# Altium project ESC.PrjPcb
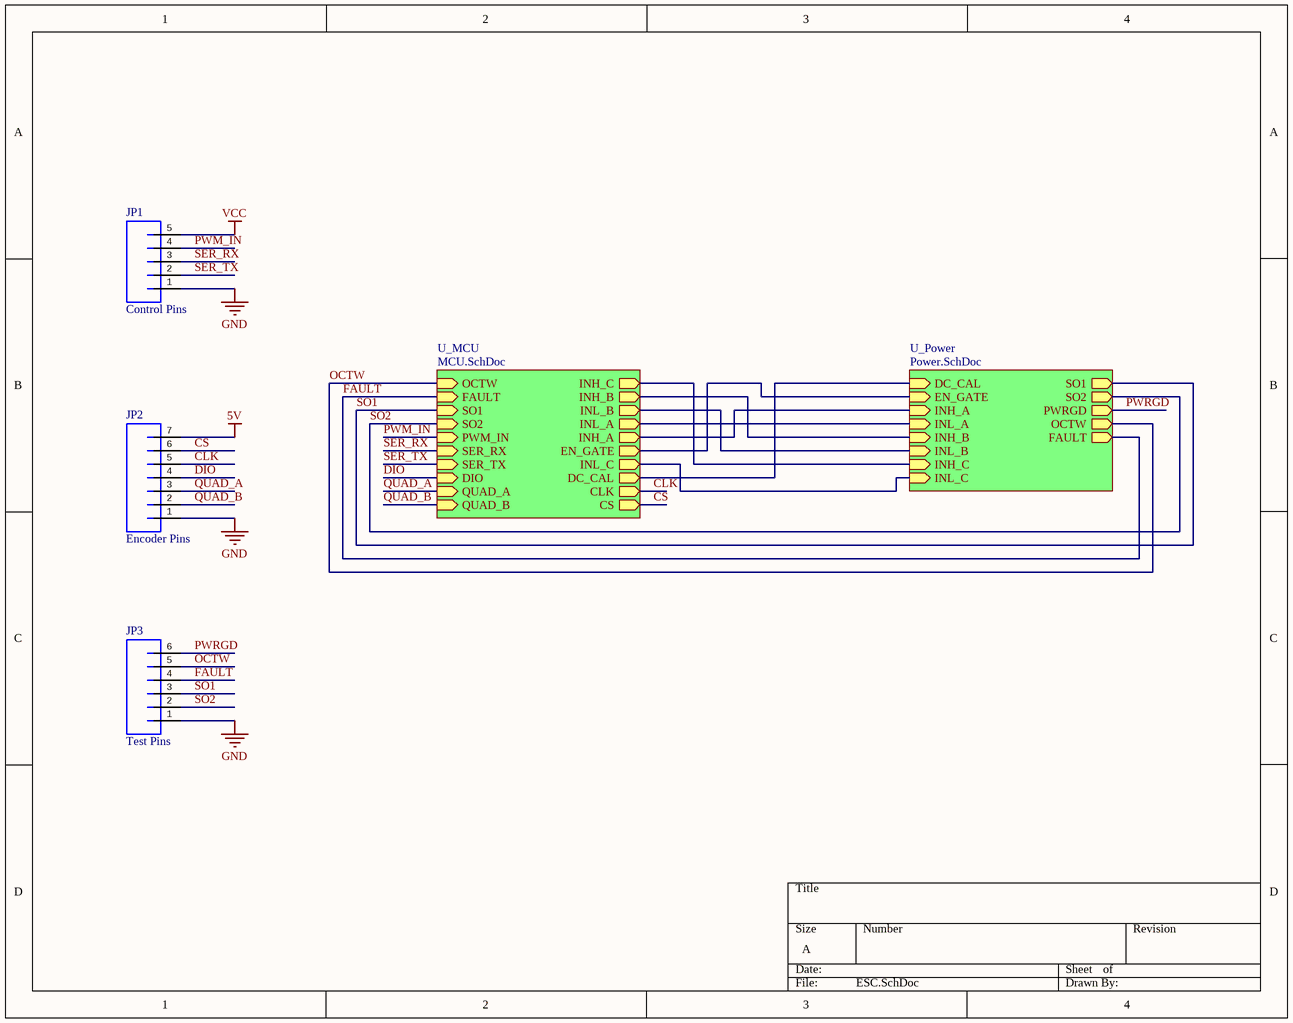
[diagram p0: ESC.SchDoc]
3 sheets, 78 parts. Net scope: hierarchical (ports join the sheet entries above them; power ports are global).
Board file: ESC.PcbDoc
Sheets:
  ESC.SchDoc
    U_Power = Power.SchDoc
    U_MCU = MCU.SchDoc

## Sheet ESC.SchDoc
size A

### Parts
JP1  Control Pins  [JST-5-PTH-VERT]
JP2  Encoder Pins  [JST-7-PTH-VERT]
JP3  Test Pins  [JST-6-PTH-VERT]

### Sub-sheets
U_MCU = MCU.SchDoc: INH_C (out), INH_B (out), INL_B (out), OCTW (in), FAULT (in), INL_A (out), INH_A (out), EN_GATE (out), INL_C (out), DC_CAL (out), SO1 (in), SO2 (in), PWM_IN (in), SER_RX (in), SER_TX (in), DIO (in), CLK (out), CS (out), QUAD_A (in), QUAD_B (in)
U_Power = Power.SchDoc: DC_CAL (in), EN_GATE (in), INH_A (in), INL_A (in), INH_B (in), INL_B (in), INH_C (in), INL_C (in), SO1 (out), SO2 (out), PWRGD (out), OCTW (out), FAULT (out)

### Nets
5V: JP2.7
GND: JP1.1 JP2.1 JP3.1
VCC: JP1.5
CLK: JP2.5 ; sheet U_MCU/CLK
CS: JP2.6 ; sheet U_MCU/CS
DIO: JP2.4 ; sheet U_MCU/DIO
FAULT: JP3.4 ; sheet U_Power/FAULT, sheet U_MCU/FAULT
OCTW: JP3.5 ; sheet U_Power/OCTW, sheet U_MCU/OCTW
PWM_IN: JP1.4 ; sheet U_MCU/PWM_IN
PWRGD: JP3.6 ; sheet U_Power/PWRGD
QUAD_A: JP2.3 ; sheet U_MCU/QUAD_A
QUAD_B: JP2.2 ; sheet U_MCU/QUAD_B
SER_RX: JP1.3 ; sheet U_MCU/SER_RX
SER_TX: JP1.2 ; sheet U_MCU/SER_TX
SO1: JP3.3 ; sheet U_Power/SO1, sheet U_MCU/SO1
SO2: JP3.2 ; sheet U_Power/SO2, sheet U_MCU/SO2
NetU1_5: sheet U_Power/INH_C, sheet U_MCU/INH_C
NetU1_9: sheet U_Power/INH_B, sheet U_MCU/INH_B
NetU1_10: sheet U_Power/INL_B, sheet U_MCU/INL_B
NetU1_19/A5: sheet U_Power/DC_CAL, sheet U_MCU/DC_CAL
NetU1_20/A6: sheet U_Power/INL_C, sheet U_MCU/INL_C
NetU1_21/A7: sheet U_Power/EN_GATE, sheet U_MCU/EN_GATE
NetU1_22/A8: sheet U_Power/INH_A, sheet U_MCU/INH_A
NetU1_23/A9: sheet U_Power/INL_A, sheet U_MCU/INL_A

### Library data of the parts
JP1 = JST_5_VERT
JP2 = JST_7_VERT
JP3 = JST_6_VERT

## Sheet Power.SchDoc
size A4
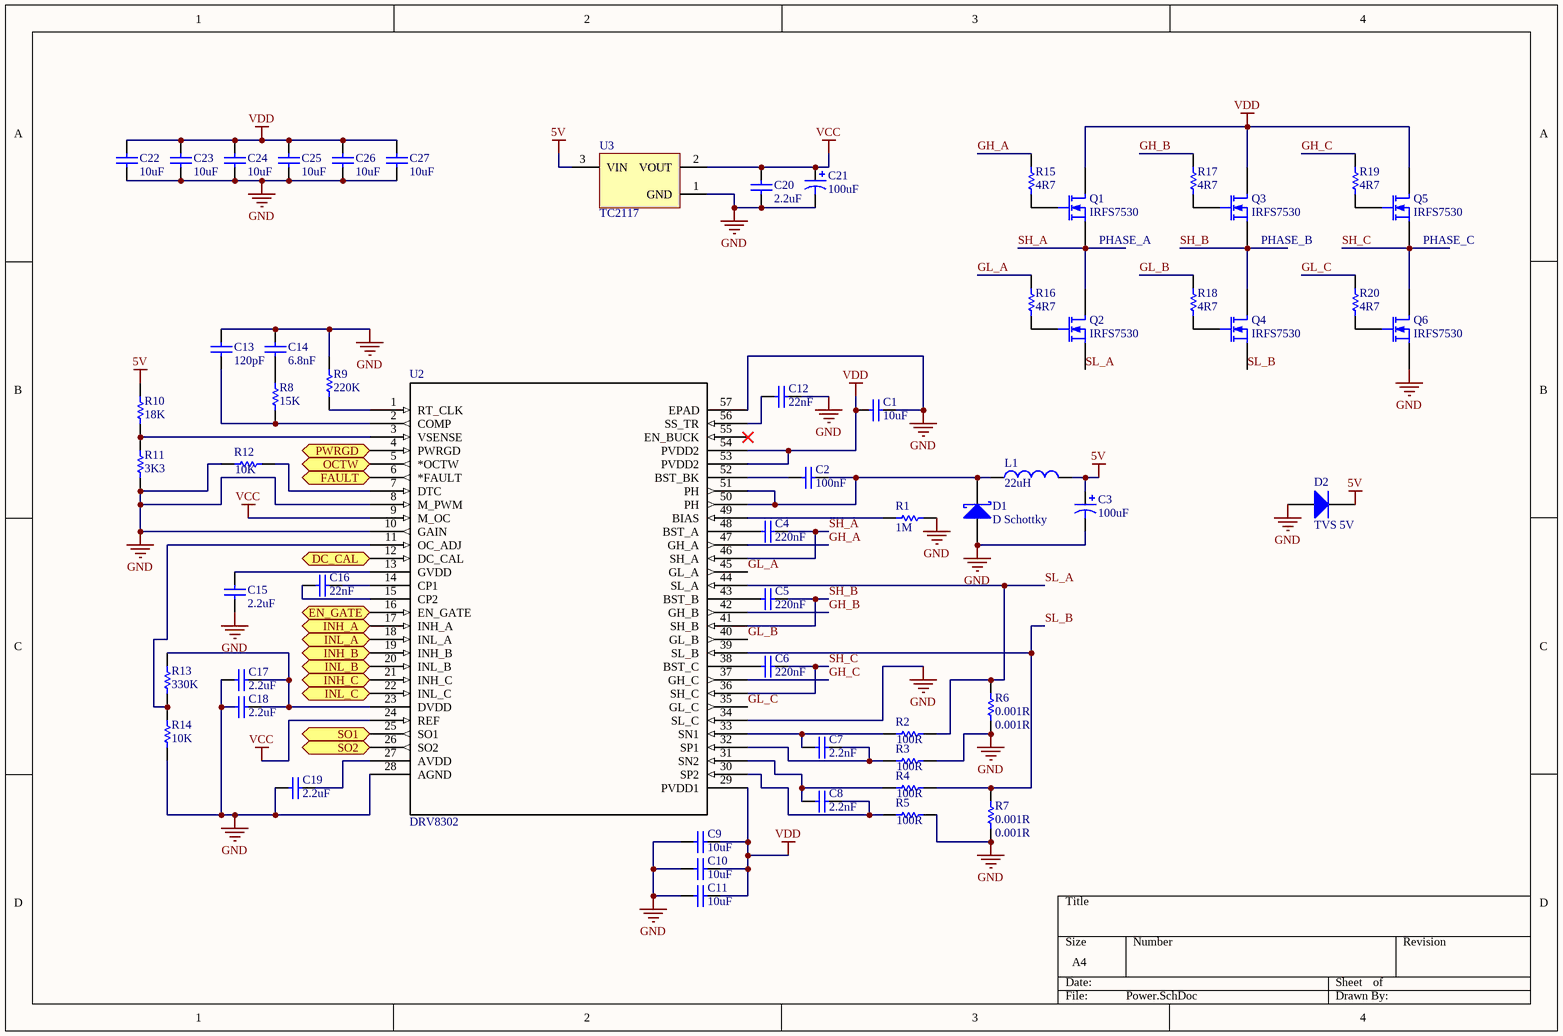
[diagram p1: Power.SchDoc]

### Parts
C1  10uF  [CAPC1206(3216)190_M]
C2  100nF  [CAPC0603(1608)100_N]
C3  100uF  [AVX-CAPC7343_V]
C4  220nF  [CAPC0805(2012)145_M]
C5  220nF  [CAPC0805(2012)145_M]
C6  220nF  [CAPC0805(2012)145_M]
C7  2.2nF  [CAPC0603(1608)100_N]
C8  2.2nF  [CAPC0603(1608)100_N]
C9  10uF  [CAPC1206(3216)190_M]
C10  10uF  [CAPC1206(3216)190_M]
C11  10uF  [CAPC1206(3216)190_M]
C12  22nF  [CAPC0603(1608)100_N]
C13  120pF  [CAPC0603(1608)100_N]
C14  6.8nF  [CAPC0603(1608)100_N]
C15  2.2uF  [CAPC0805(2012)145_N]
C16  22nF  [CAPC0603(1608)100_N]
C17  2.2uF  [CAPC0603(1608)55_N]
C18  2.2uF  [CAPC0603(1608)55_N]
C19  2.2uF  [CAPC0805(2012)145_N]
C20  2.2uF  [CAPC0603(1608)55_N]
C21  100uF  [AVX-CAPC7343_V]
C22  10uF  [CAPC1206(3216)190_M]
C23  10uF  [CAPC1206(3216)190_M]
C24  10uF  [CAPC1206(3216)190_M]
C25  10uF  [CAPC1206(3216)190_M]
C26  10uF  [CAPC1206(3216)190_M]
C27  10uF  [CAPC1206(3216)190_M]
D1  D Schottky  [SMB]
D2  TVS 5V  [VISH-DO-214AC-2_N]
L1  value 22uH  [SDR0805-180ML]  (hidden comment: SDR0805-180ML)
Q1  IRFS7530  [DPAK127P1525X483-7N]
Q2  IRFS7530  [DPAK127P1525X483-7N]
Q3  IRFS7530  [DPAK127P1525X483-7N]
Q4  IRFS7530  [DPAK127P1525X483-7N]
Q5  IRFS7530  [DPAK127P1525X483-7N]
Q6  IRFS7530  [DPAK127P1525X483-7N]
R1  1M  [RESC0603(1608)_N]
R2  100R  [RESC0603(1608)_N]
R3  100R  [RESC0603(1608)_N]
R4  100R  [RESC0603(1608)_N]
R5  100R  [RESC0603(1608)_N]
R6  0.001R  [Shunt]
R7  0.001R  [Shunt]
R8  15K  [RESC0603(1608)_N]
R9  220K  [RESC0603(1608)_N]
R10  18K  [RESC0603(1608)_N]
R11  3K3  [RESC0603(1608)_N]
R12  10K  [RESC0603(1608)_N]
R13  330K  [RESC0603(1608)_N]
R14  10K  [RESC0603(1608)_N]
R15  4R7  [RESC0603(1608)_N]
R16  4R7  [RESC0603(1608)_N]
R17  4R7  [RESC0603(1608)_M]
R18  4R7  [RESC0603(1608)_N]
R19  4R7  [RESC0603(1608)_N]
R20  4R7  [RESC0603(1608)_N]
U2  DRV8302  [DCA56_6P35X3P61]
U3  TC2117  [SOT-223-DB3_M]

### Ports
DC_CAL (in), EN_GATE (in), FAULT (out), INH_A (in), INH_B (in), INH_C (in), INL_A (in), INL_B (in), INL_C (in), OCTW (out), PWRGD (out), SO1 (out), SO2 (out)

### Nets
5V: C3.1 D2.1(K) L1.2 R10.1 U3.3(VIN)
GND: C1.2 C3.2 C9.1 C10.1 C11.1 C12.2 C13.1 C14.1 C15.2 C17.1 C18.1 C19.1 C20.2 C21.2 C22.1 C23.1 C24.1 C25.1 C26.1 C27.1 D1.1(A) D2.2(A) Q6.3(S) R1.2 R3.2 R5.2 R6.1 R7.1 R9.1 R11.2 R12.1 R14.2 U2.8(M_PWM) U2.10(GAIN) U2.28(AGND) U2.34(SL_C) U2.57(EPAD) U3.1(GND)
VCC: C20.1 C21.1 U2.9(M_OC) U2.24(REF) U3.2(VOUT)
VDD: C1.1 C9.2 C10.2 C11.2 C22.2 C23.2 C24.2 C25.2 C26.2 C27.2 Q1.1(D) Q3.1(D) Q5.1(D) U2.29(PVDD1) U2.53(PVDD2) U2.54(PVDD2)
FAULT: U2.6(*FAULT) ; port FAULT
GH_A: R15.2 U2.47(GH_A)
GH_B: R17.2 U2.42(GH_B)
GH_C: R19.2 U2.37(GH_C)
GL_A: R16.2 U2.45(GL_A)
GL_B: R18.2 U2.40(GL_B)
GL_C: R20.2 U2.35(GL_C)
OCTW: U2.5(*OCTW) ; port OCTW
PWRGD: U2.4(PWRGD) ; port PWRGD
SH_A: C4.2 Q1.3(S) Q2.1(D) U2.46(SH_A)
SH_B: C5.2 Q3.3(S) Q4.1(D) U2.41(SH_B)
SH_C: C6.2 Q5.3(S) Q6.1(D) U2.36(SH_C)
SL_A: Q2.3(S) R2.2 R6.2 U2.44(SL_A)
SL_B: Q4.3(S) R4.2 R7.2 U2.39(SL_B)
SO1: U2.25(SO1) ; port SO1
SO2: U2.26(SO2) ; port SO2
NetC2_1: C2.1 U2.52(BST_BK)
NetC2_2: C2.2 D1.2(K) L1.1 U2.50(PH) U2.51(PH)
NetC4_1: C4.1 U2.48(BST_A)
NetC5_1: C5.1 U2.43(BST_B)
NetC6_1: C6.1 U2.38(BST_C)
NetC7_1: C7.1 R2.1 U2.33(SN1)
NetC7_2: C7.2 R3.1 U2.32(SP1)
NetC8_1: C8.1 R4.1 U2.31(SN2)
NetC8_2: C8.2 R5.1 U2.30(SP2)
NetC12_1: C12.1 U2.56(SS_TR)
NetC13_2: C13.2 R8.2 U2.2(COMP)
NetC14_2: C14.2 R8.1
NetC15_1: C15.1 U2.13(GVDD)
NetC16_1: C16.1 U2.15(CP2)
NetC16_2: C16.2 U2.14(CP1)
NetC17_2: C17.2 C18.2 R13.1 U2.23(DVDD)
NetC19_2: C19.2 U2.27(AVDD)
NetQ1_2: Q1.2(G) R15.1
NetQ2_2: Q2.2(G) R16.1
NetQ3_2: Q3.2(G) R17.1
NetQ4_2: Q4.2(G) R18.1
NetQ5_2: Q5.2(G) R19.1
NetQ6_2: Q6.2(G) R20.1
NetR1_1: R1.1 U2.49(BIAS)
NetR9_2: R9.2 U2.1(RT_CLK)
NetR10_2: R10.2 R11.1 U2.3(VSENSE)
NetR12_2: R12.2 U2.7(DTC)
NetR13_2: R13.2 R14.1 U2.11(OC_ADJ)
NetU1_5: U2.21(INH_C) ; port INH_C
NetU1_9: U2.19(INH_B) ; port INH_B
NetU1_10: U2.20(INL_B) ; port INL_B
NetU1_19/A5: U2.12(DC_CAL) ; port DC_CAL
NetU1_20/A6: U2.22(INL_C) ; port INL_C
NetU1_21/A7: U2.16(EN_GATE) ; port EN_GATE
NetU1_22/A8: U2.17(INH_A) ; port INH_A
NetU1_23/A9: U2.18(INL_A) ; port INL_A

Not connected (* = marked no-connect by the designer): U2 55(EN_BUCK)*

### Notes on the sheet
- (near Q1) PHASE_A
- (near Q3) PHASE_B
- (near Q5) PHASE_C

### Library data of the parts
C1 C9-C11 C22-C27 = CMP-1037-04982-1: CAP 10uF 50V Â±10% 1206 (3216 Metric) Thickness 1.9mm SMD; Case-EIA: 1206; Case-Metric: 3216; Technology: SMT; Tolerance: Â±10%; Max Thickness: 1.9 mm; Value: 10uF; Rated Voltage: 50 V
C2 = CMP-1035-02591-1: CAP 100nF 50V Â±5% 0603 (1608 Metric) Thickness 1mm SMD; Case-Metric: 1608; Case-EIA: 0603; Rated Voltage: 50 V; Max Thickness: 1 mm; Tolerance: Â±5%; Technology: SMT; Value: 100nF
C3 C21 = CMP-0279-00002-1: Capacitor, Tantalum, 220uF 10% 10V MCCT-D (7343-31); PartNumber: TAJD227K010R; Manufacturer: AVX; Polarity: Polarized; ComponentLink2URL: http://www.avx.com/docs/Catalogs/taj.pdf; PackageReference: CAPC7343; ComponentLink2Description: Datasheet; ComponentLink1URL: http://www.avx.com/; Mounting Technology: Surface Mount; Technology: Tantalum; Tolerance: 10%; Capacitance: 220uF; Rated Voltage: 10V; PackageDescription: 2-Pin SMT Capacitor, 7.3 x 4.3 mm Body; ComponentLink1Description: Manufacturer URL; DatasheetVersion: Jul-13
C4-C6 = CMP-1036-04540-1: CAP 220nF 25V Â±5% 0805 (2012 Metric) Thickness 1.45mm SMD; Case-EIA: 0805; Case-Metric: 2012; Technology: SMT; Max Thickness: 1.45 mm; Tolerance: Â±5%; Rated Voltage: 25 V; Value: 220nF
C7 C8 = CMP-1035-02036-1: CAP 2.2nF 50V Â±1% 0603 (1608 Metric) Thickness 1mm SMD; Case-EIA: 0603; Case-Metric: 1608; Max Thickness: 1 mm; Tolerance: Â±1%; Technology: SMT; Value: 2.2nF; Rated Voltage: 50 V
C12 C16 = CMP-1035-02425-1: CAP 22nF 50V Â±5% 0603 (1608 Metric) Thickness 1mm SMD; Case-EIA: 0603; Case-Metric: 1608; Max Thickness: 1 mm; Technology: SMT; Value: 22nF; Tolerance: Â±5%; Rated Voltage: 50 V
C13 = CMP-1035-01317-1: CAP 120pF 50V Â±1% 0603 (1608 Metric) Thickness 1mm SMD; Case-EIA: 0603; Case-Metric: 1608; Technology: SMT; Value: 120pF; Max Thickness: 1 mm; Rated Voltage: 50 V; Tolerance: Â±1%
C14 = CMP-1035-02266-1: CAP 6.8nF 50V Â±1% 0603 (1608 Metric) Thickness 1mm SMD; Case-Metric: 1608; Case-EIA: 0603; Tolerance: Â±1%; Value: 6.8nF; Technology: SMT; Max Thickness: 1 mm; Rated Voltage: 50 V
C15 C19 = CMP-1036-04830-1: CAP 2.2uF 16V Â±5% 0805 (2012 Metric) Thickness 1.45mm SMD; Case-EIA: 0805; Case-Metric: 2012; Rated Voltage: 16 V; Technology: SMT; Value: 2.2uF; Max Thickness: 1.45 mm; Tolerance: Â±5%
C17 C18 C20 = CMP-1035-02762-1: CAP 2.2uF 16V Â±10% 0603 (1608 Metric) Thickness 0.55mm SMD; Case-EIA: 0603; Case-Metric: 1608; Max Thickness: 0.55 mm; Technology: SMT; Value: 2.2uF; Rated Voltage: 16 V; Tolerance: Â±10%
D1 = D Schottky: Schottky Diode; Published: 8-Jun-2000; LatestRevisionDate: 17-Jul-2002; LatestRevisionNote: Re-released for DXP Platform.; PackageReference: SMB; Publisher: Altium Limited; PackageDescription: DO-214-AA/SMB; 2 C-Bend Leads; Body 5.3 x 3.6 mm, inc. leads (LxW); Code_JEDEC: DO-214-AA
D2 = CMP-0548-00235-1: Transient Voltage Suppressor, 6.40 to 231 V, 5 V Stand-off Voltage, Uni-Directional, -55 to 155 degC, 2-pin DO-214AC, Pb-Free, Tape and Reel; PartNumber: SMAJ5.0A-E3/61; Manufacturer: Vishay Semiconductor; ID (uA): 800; IFSM: 40 A; VBR Uni-Directional (V): 6.4 to 231; PPPM (W): 400, 300; VWM (V): 5; PackageDescription: 2-Pin DO-214AC (SMA), Body 4.245 x 2.665 mm; Mounting Technology: Surface Mount; ComponentLink3Description: Package Specification; ComponentLink1URL: http://www.vishay.com/; Operating Junction and Storage Temperature Range: -55 to 150 degC; PackageReference: DO-214AC-2; ComponentLink2URL: http://www.vishay.com/docs/88390/smaj50a.pdf; Packing: Tape and Reel; RoHS: TRUE; DatasheetVersion: 12/8/2013; ComponentLink3URL: http://www.vishay.com/docs/88390/smaj50a.pdf; ComponentLink1Description: Manufacturer URL; ComponentLink2Description: Datasheet
L1 = SDR0805-180ML: Inductor; Code_IEC: 1005; Published: 8-Jun-2000; LatestRevisionDate: 29-May-2009; LatestRevisionNote: IPC-7351 Footprint Added.; PackageReference: 0402-A; Publisher: Altium Limited; PackageDescription: Chip Inductor; Code_JEITA: 0402
Q1-Q6 = IRFS7530: N-Channel MOSFET; pin to pad: 1>8 2>1 3>2+3+5+6+7; Published: 8-Jun-2000; LatestRevisionDate: 17-Jul-2002; LatestRevisionNote: Re-released for DXP Platform.; PackageVersion: 1995/1996; PackageReference: E3; Publisher: Altium Limited; PackageDescription: TO, Flat Index; 3 In-Line, Axial Leads; Body Dia. 4.6mm; Lead Dia. 0.5 mm (max)
R1 = CMP-1012-00146-1: 1M 0.1W 5% 0603 (1608 Metric)  SMD; Case-EIA: 0603; Value: 1000000.00 Ohm; Case-Metric: 1608; Technology: SMT; Power: 0.1 W; Tolerance: 5 %
R2-R5 = CMP-1012-00050-1: 100R 0.1W 5% 0603 (1608 Metric)  SMD; Case-EIA: 0603; Value: 100.00 Ohm; Case-Metric: 1608; Tolerance: 5 %; Technology: SMT; Power: 0.1 W
R6 R7 = Shunt: Resistor; Published: 8-Jun-2000; LatestRevisionDate: 17-Jul-2002; LatestRevisionNote: Re-released for DXP Platform.; PackageReference: AXIAL-0.3; Publisher: Altium Limited; PackageDescription: Axial Device, Thru-Hole; 2 Leads; 0.3 in Pin Spacing; Value: 0.001R
R8 = CMP-1012-00102-1: 15K 0.1W 5% 0603 (1608 Metric)  SMD; Value: 15000.00 Ohm; Case-Metric: 1608; Case-EIA: 0603; Power: 0.1 W; Technology: SMT; Tolerance: 5 %
R9 = CMP-1012-00130-1: 220K 0.1W 5% 0603 (1608 Metric)  SMD; Case-Metric: 1608; Case-EIA: 0603; Value: 220000.00 Ohm; Technology: SMT; Tolerance: 5 %; Power: 0.1 W
R10 = CMP-1012-00104-1: 18K 0.1W 5% 0603 (1608 Metric)  SMD; Case-Metric: 1608; Case-EIA: 0603; Value: 18000.00 Ohm; Technology: SMT; Power: 0.1 W; Tolerance: 5 %
R11 = CMP-1012-00086-1: 3K3 0.1W 5% 0603 (1608 Metric)  SMD; Case-EIA: 0603; Value: 3300.00 Ohm; Case-Metric: 1608; Technology: SMT; Tolerance: 5 %; Power: 0.1 W
R12 R14 = CMP-1012-00098-1: 10K 0.1W 5% 0603 (1608 Metric)  SMD; Case-EIA: 0603; Value: 10000.00 Ohm; Case-Metric: 1608; Technology: SMT; Tolerance: 5 %; Power: 0.1 W
R13 = CMP-1012-00134-1: 330K 0.1W 5% 0603 (1608 Metric)  SMD; Case-Metric: 1608; Value: 330000.00 Ohm; Case-EIA: 0603; Power: 0.1 W; Tolerance: 5 %; Technology: SMT
R15-R20 = CMP-1012-00018-1: 4R7 0.1W 5% 0603 (1608 Metric)  SMD; Value: 4.70 Ohm; Case-EIA: 0603; Case-Metric: 1608; Power: 0.1 W; Tolerance: 5 %; Technology: SMT
U2 = DRV8302_DCA_56: Imported; Manufacturer: Texas Instruments; INDUSTRY_STD_PKG_TYPE: HTSSOP; FAMILY_NAME: 3-PHASE BRUSHLESS PRE-DRIVER; PIN_COUNT: 56; PACKAGE_DESIGNATOR: DCA; Datasheet URL: http://www.ti.com/lit/gpn/DRV8302; GENERIC_PART_NUMBER: DRV8302; Vendor: Texas Instruments; Manufacturer_Part_Number: drv8302_dca_56; RefDes: RefDes; Type: DEV; Value: Value
U3 = PM-LINEREG-TC2117-IL4: pin to pad: 2>2+4

## Sheet MCU.SchDoc
size A
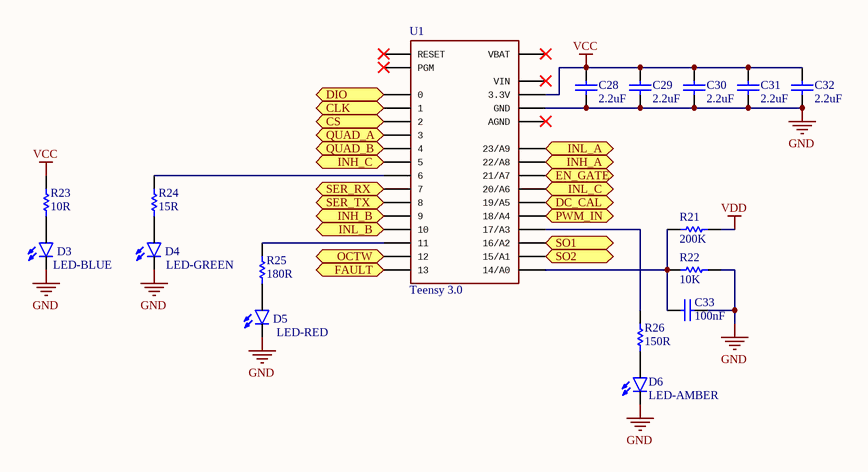
[diagram p2: MCU.SchDoc]

### Parts
C28  2.2uF  [CAPC0603(1608)55_N]
C29  2.2uF  [CAPC0603(1608)55_N]
C30  2.2uF  [CAPC0603(1608)55_N]
C31  2.2uF  [CAPC0603(1608)55_N]
C32  2.2uF  [CAPC0603(1608)55_N]
C33  100nF  [CAPC0603(1608)100_L]
D3  LED-BLUE  [LED-1206]
D4  LED-GREEN  [LED-1206]
D5  LED-RED  [LED-1206]
D6  LED-AMBER  [LED-1206]
R21  200K  [RESC0603(1608)_M]
R22  10K  [RESC0603(1608)_N]
R23  10R  [RESC0603(1608)_L]
R24  15R  [RESC0603(1608)_L]
R25  180R  [RESC0603(1608)_L]
R26  150R  [RESC0603(1608)_L]
U1  Teensy 3.0  [TEENSY_3.0_BASIC]

### Ports
CLK (out), CS (out), DC_CAL (out), DIO (in), EN_GATE (out), FAULT (in), INH_A (out), INH_B (out), INH_C (out), INL_A (out), INL_B (out), INL_C (out), OCTW (in), PWM_IN (in), QUAD_A (in), QUAD_B (in), SER_RX (in), SER_TX (in), SO1 (in), SO2 (in)

### Nets
GND: C28.1 C29.1 C30.1 C31.1 C32.1 C33.2 D3.C D4.C D5.C D6.C R22.2 U1.GND_GND1(GND)
VCC: C28.2 C29.2 C30.2 C31.2 C32.2 R23.2 U1.3.3V_3.3V1(3.3V)
VDD: R21.2
CLK: U1.1 ; port CLK
CS: U1.2 ; port CS
DIO: U1.0 ; port DIO
FAULT: U1.13 ; port FAULT
OCTW: U1.12 ; port OCTW
PWM_IN: U1.18/A4 ; port PWM_IN
QUAD_A: U1.3 ; port QUAD_A
QUAD_B: U1.4 ; port QUAD_B
SER_RX: U1.7 ; port SER_RX
SER_TX: U1.8 ; port SER_TX
SO1: U1.16/A2 ; port SO1
SO2: U1.15/A1 ; port SO2
NetC33_1: C33.1 R21.1 R22.1 U1.14/A0
NetD3_A: D3.A R23.1
NetD4_A: D4.A R24.1
NetD5_A: D5.A R25.1
NetD6_A: D6.A R26.1
NetR24_2: R24.2 U1.6
NetR25_2: R25.2 U1.11
NetR26_2: R26.2 U1.17/A3
NetU1_5: U1.5 ; port INH_C
NetU1_9: U1.9 ; port INH_B
NetU1_10: U1.10 ; port INL_B
NetU1_19/A5: U1.19/A5 ; port DC_CAL
NetU1_20/A6: U1.20/A6 ; port INL_C
NetU1_21/A7: U1.21/A7 ; port EN_GATE
NetU1_22/A8: U1.22/A8 ; port INH_A
NetU1_23/A9: U1.23/A9 ; port INL_A

Not connected (* = marked no-connect by the designer): U1 AGND* PGM* RESET* VBAT* VIN*

### Library data of the parts
C28-C32 = CMP-1035-02762-1: as C17 on sheet Power; Max Thickness: 0.55 mm; Technology: SMT; Value: 2.2uF; Rated Voltage: 16 V; Tolerance: Â±10%
C33 = CMP-1035-02591-1: as C2 on sheet Power; Rated Voltage: 50 V; Max Thickness: 1 mm; Tolerance: Â±5%; Technology: SMT; Value: 100nF
D3 = LED-BLUE1206: PROD_ID: DIO-09911
D4 = LED-GREEN1206: PROD_ID: DIO-00862
D5 = LED-RED1206: PROD_ID: DIO-09912
D6 = LED-AMBER1206
R21 = CMP-1012-00129-1: 200K 0.1W 5% 0603 (1608 Metric)  SMD; Case-EIA: 0603; Value: 200000.00 Ohm; Case-Metric: 1608; Technology: SMT; Power: 0.1 W; Tolerance: 5 %
R22 = CMP-1012-00098-1: as R12 on sheet Power; Technology: SMT; Tolerance: 5 %; Power: 0.1 W
R23 = CMP-1012-00026-1: 10R 0.1W 5% 0603 (1608 Metric)  SMD; Case-Metric: 1608; Case-EIA: 0603; Value: 10.00 Ohm; Technology: SMT; Tolerance: 5 %; Power: 0.1 W
R24 = CMP-1012-00030-1: 15R 0.1W 5% 0603 (1608 Metric)  SMD; Case-EIA: 0603; Case-Metric: 1608; Value: 15.00 Ohm; Tolerance: 5 %; Technology: SMT; Power: 0.1 W
R25 = CMP-1012-00056-1: 180R 0.1W 5% 0603 (1608 Metric)  SMD; Value: 180.00 Ohm; Case-EIA: 0603; Case-Metric: 1608; Power: 0.1 W; Technology: SMT; Tolerance: 5 %
R26 = CMP-1012-00054-1: 150R 0.1W 5% 0603 (1608 Metric)  SMD; Case-EIA: 0603; Value: 150.00 Ohm; Case-Metric: 1608; Power: 0.1 W; Tolerance: 5 %; Technology: SMT
U1 = TEENSY_3.0_BASIC

## Nets that join several sheets
5V: ESC (JP2.7), Power (5 pins)
GND: ESC (JP1.1 JP2.1 JP3.1), Power (38 pins), MCU (12 pins)
VCC: ESC (JP1.5), Power (5 pins), MCU (7 pins)
VDD: Power (16 pins), MCU (R21.2)
CLK: ESC (JP2.5), MCU (U1.1)
CS: ESC (JP2.6), MCU (U1.2)
DIO: ESC (JP2.4), MCU (U1.0)
FAULT: ESC (JP3.4), Power (U2.6), MCU (U1.13)
NetU1_5: Power (U2.21), MCU (U1.5)
NetU1_9: Power (U2.19), MCU (U1.9)
NetU1_10: Power (U2.20), MCU (U1.10)
NetU1_19/A5: Power (U2.12), MCU (U1.19/A5)
NetU1_20/A6: Power (U2.22), MCU (U1.20/A6)
NetU1_21/A7: Power (U2.16), MCU (U1.21/A7)
NetU1_22/A8: Power (U2.17), MCU (U1.22/A8)
NetU1_23/A9: Power (U2.18), MCU (U1.23/A9)
OCTW: ESC (JP3.5), Power (U2.5), MCU (U1.12)
PWM_IN: ESC (JP1.4), MCU (U1.18/A4)
PWRGD: ESC (JP3.6), Power (U2.4)
QUAD_A: ESC (JP2.3), MCU (U1.3)
QUAD_B: ESC (JP2.2), MCU (U1.4)
SER_RX: ESC (JP1.3), MCU (U1.7)
SER_TX: ESC (JP1.2), MCU (U1.8)
SO1: ESC (JP3.3), Power (U2.25), MCU (U1.16/A2)
SO2: ESC (JP3.2), Power (U2.26), MCU (U1.15/A1)